# Altium schematic sheet HD-JYQ70-YD03-POWER.SchDoc
size B; PageSetup: Record=PageOptions|CenterHorizontal=True|CenterVertical=True|PrintScale=0.74|XCorrection=1.00|YCorrection=1.00|PrintKind=1|BorderSize=5000000|LeftOffset=0|BottomOffset=0|Orientation=2|PaperLength=1000|PaperWidth=1000|Scale=100|PaperSource=7|PrintQuality=-3|MediaType=1|DitherType=10|PrintScaleMode=1|PaperKind=A4 (210 x 297 mm)|PaperIndex=9
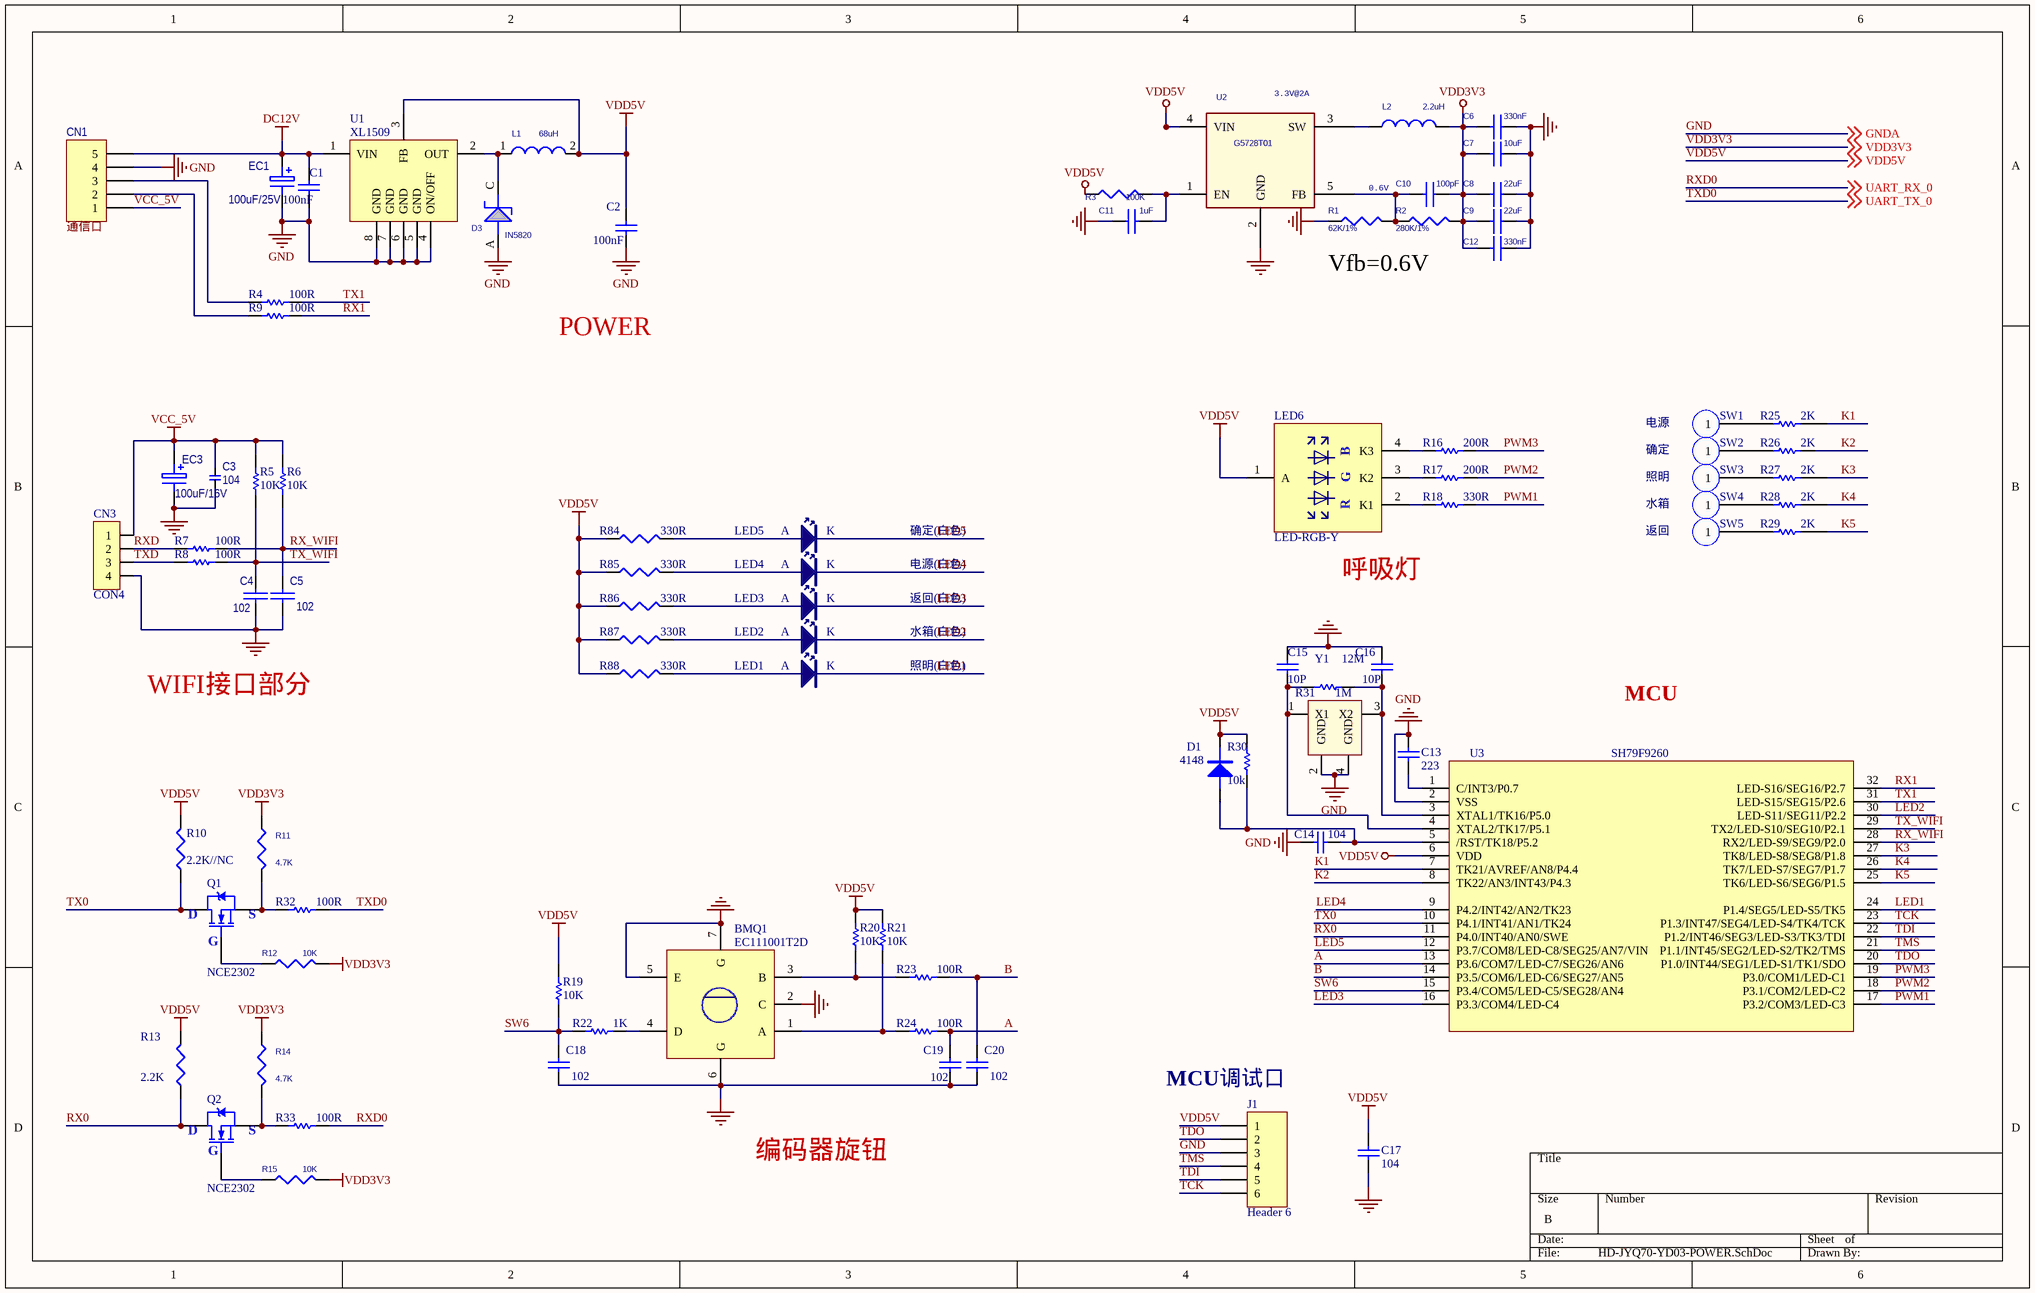
[diagram p0: HD-JYQ70-YD03-POWER.SchDoc]

## Parts
BMQ1  EC111001T2D  [EC111001T2D]
C1  value 100nF  [X-0603C]  (hidden comment: Cap Semi)
C2  value 100nF  [X-0603C]  (hidden comment: Cap Semi)
C3  104  [X-0603C]
C4  102  [X-0603C]
C5  102  [X-0603C]
C6  330nF  [X-0603C]
C7  10uF  [X-0805C]
C8  22uF  [X-0805C]
C9  22uF  [X-0805C]
C10  100pF  [X-0603C]
C11  1uF  [X-0603C]
C12  330nF  [X-0805C]
C13  value 223  [X-0603C]  (hidden comment: Cap)
C14  value 104  [X-0603C]  (hidden comment: Cap)
C15  value 10P  [X-0603C]  (hidden comment: Cap)
C16  value 10P  [X-0603C]  (hidden comment: Cap)
C17  value 104  [X-0603C]  (hidden comment: Cap)
C18  value 102  [X-0603C]  (hidden comment: Cap)
C19  value 102  [X-0603C]  (hidden comment: Cap)
C20  value 102  [X-0603C]  (hidden comment: Cap)
CN1  通信口  [JC25-5Y]
CN3  CON4  [CoN-JC25-4Y]
D1  4148  [H-DIODE_SMA]
D3  IN5820  [DO-214AC]
EC1  100uF/25V  [C6*8*6]
EC3  100uF/16V  [C6*8*6]
J1  Header 6  [CON_TJC8-6A]
L1  68uH  [ZAD-6045]
L2  2.2uH  [ZAD-4030]
LED1  (no value)  [LED2P-5MM]
LED2  (no value)  [LED2P-5MM]
LED3  (no value)  [LED2P-5MM]
LED4  (no value)  [LED2P-5MM]
LED5  (no value)  [LED2P-5MM]
LED6  LED-RGB-Y  [LED-RGB-Y]
Q1  NCE2302  [X-SOT23]
Q2  NCE2302  [X-SOT23]
R1  62K/1%  [X-0603R]
R2  280K/1%  [X-0603R]
R3  100K  [X-0603R]
R4  value 100R  [X-0603R]  (hidden comment: Res1)
R5  value 10K  [X-0603R]  (hidden comment: Res1)
R6  value 10K  [X-0603R]  (hidden comment: Res1)
R7  value 100R  [X-0603R]  (hidden comment: Res1)
R8  value 100R  [X-0603R]  (hidden comment: Res1)
R9  value 100R  [X-0603R]  (hidden comment: Res1)
R10  value 2.2K//NC  [X-0603R]  (hidden comment: 2.2K)
R11  4.7K  [X-0603R]
R12  10K  [X-0603R]
R13  2.2K  [X-0603R]
R14  4.7K  [X-0603R]
R15  10K  [X-0603R]
R16  value 200R  [X-0603R]  (hidden comment: Res1)
R17  value 200R  [X-0603R]  (hidden comment: Res1)
R18  value 330R  [X-0603R]  (hidden comment: Res1)
R19  value 10K  [X-0603R]  (hidden comment: Res1)
R20  value 10K  [X-0603R]  (hidden comment: Res1)
R21  value 10K  [X-0603R]  (hidden comment: Res1)
R22  value 1K  [X-0603R]  (hidden comment: Res1)
R23  value 100R  [X-0603R]  (hidden comment: Res1)
R24  value 100R  [X-0603R]  (hidden comment: Res1)
R25  value 2K  [X-0603R]  (hidden comment: Res1)
R26  value 2K  [X-0603R]  (hidden comment: Res1)
R27  value 2K  [X-0603R]  (hidden comment: Res1)
R28  value 2K  [X-0603R]  (hidden comment: Res1)
R29  value 2K  [X-0603R]  (hidden comment: Res1)
R30  value 10k  [X-0603R]  (hidden comment: Res1)
R31  value 1M  [X-0603R]  (hidden comment: Res1)
R32  value 100R  [X-0603R]  (hidden comment: Res1)
R33  value 100R  [X-0603R]  (hidden comment: Res1)
R84  value 330R  [X-0603R]  (hidden comment: 10K)
R85  value 330R  [X-0603R]  (hidden comment: 10K)
R86  value 330R  [X-0603R]  (hidden comment: 10K)
R87  value 330R  [X-0603R]  (hidden comment: 10K)
R88  value 330R  [X-0603R]  (hidden comment: 10K)
SW1  返回  [SW-14]
SW2  确定  [SW-14]
SW3  电源  [SW-14]
SW4  水箱  [SW-14]
SW5  照明  [SW-14]
U1  XL1509  [X-SOP8-50-150]
U2  G5728T01  [TSOT25-5P$2F$0.95$2F$3X3]
U3  SH79F9260  [X-QFP32-080-0707L]
Y1  12M  [CRYSTALS-SMD-320X250]

## Nets
DC12V: C1.2 CN1.5 EC1.1 U1.1(VIN)
GND: BMQ1.2(C) BMQ1.5(E) BMQ1.6(G) BMQ1.7(G) C1.1 C2.1 C3.2 C4.1 C5.1 C6.1 C7.1 C8.1 C9.1 C11.1 C12.1 C13.2 C14.1 C15.2 C16.2 C17.1 C18.1 C19.1 C20.1 CN1.4 CN3.4 D3.A(ANODE) EC1.2 EC3.2 J1.3 R1.1 U1.4(ON/OFF) U1.5(GND) U1.6(GND) U1.7(GND) U1.8(GND) U2.2(GND) U3.2(VSS) Y1.2(GND) Y1.4(GND) ; off-sheet GNDA  [also labelled GNDA]
VCC_5V: C3.1 CN1.1 CN3.1 EC3.1 R5.2 R6.2
VDD3V3: C6.2 C7.2 C8.2 C9.2 C10.1 C12.2 L2.2 R2.2 R11.1 R12.2 R14.1 R15.2 ; off-sheet VDD3V3
VDD5V: C2.2 C17.2 D1.2(K) J1.1 L1.2 LED6.1(A) R3.1 R10.2 R13.2 R19.2 R20.2 R21.2 R30.2 R84.1 R85.1 R86.1 R87.1 R88.1 U1.3(FB) U2.4(VIN) U3.6(VDD) ; off-sheet VDD5V
A: C19.2 R24.2 U3.13(P3.6/COM7/LED-C7/SEG26/AN6)
B: C20.2 R23.2 U3.14(P3.5/COM6/LED-C6/SEG27/AN5)
K1: R25.2 U3.7(TK21/AVREF/AN8/P4.4)
K2: R26.2 U3.8(TK22/AN3/INT43/P4.3)
K3: R27.2 U3.27(TK8/LED-S8/SEG8/P1.8)
K4: R28.2 U3.26(TK7/LED-S7/SEG7/P1.7)
K5: R29.2 U3.25(TK6/LED-S6/SEG6/P1.5)
LED1: LED1.K U3.24(P1.4/SEG5/LED-S5/TK5)
LED2: LED2.K U3.30(LED-S11/SEG11/P2.2)
LED3: LED3.K U3.16(P3.3/COM4/LED-C4)
LED4: LED4.K U3.9(P4.2/INT42/AN2/TK23)
LED5: LED5.K U3.12(P3.7/COM8/LED-C8/SEG25/AN7/VIN)
PWM1: R18.2 U3.17(P3.2/COM3/LED-C3)
PWM2: R17.2 U3.18(P3.1/COM2/LED-C2)
PWM3: R16.2 U3.19(P3.0/COM1/LED-C1)
RX0: Q2.2(D) R13.1 U3.11(P4.0/INT40/AN0/SWE)
RX1: R9.2 U3.32(LED-S16/SEG16/P2.7)
RX_WIFI: C5.2 R6.1 R7.2 U3.28(RX2/LED-S9/SEG9/P2.0)
RXD: CN3.2 R7.1
RXD0: R33.2 ; off-sheet UART_RX_0  [also labelled UART_RX_0]
SW6: C18.2 R19.1 R22.1 U3.15(P3.4/COM5/LED-C5/SEG28/AN4)
TCK: J1.6 U3.23(P1.3/INT47/SEG4/LED-S4/TK4/TCK)
TDI: J1.5 U3.22(P1.2/INT46/SEG3/LED-S3/TK3/TDI)
TDO: J1.2 U3.20(P1.0/INT44/SEG1/LED-S1/TK1/SDO)
TMS: J1.4 U3.21(P1.1/INT45/SEG2/LED-S2/TK2/TMS)
TX0: Q1.2(D) R10.1 U3.10(P4.1/INT41/AN1/TK24)
TX1: R4.2 U3.31(LED-S15/SEG15/P2.6)
TX_WIFI: C4.2 R5.1 R8.2 U3.29(TX2/LED-S10/SEG10/P2.1)
TXD: CN3.3 R8.1
TXD0: R32.2 ; off-sheet UART_TX_0  [also labelled UART_TX_0]
NetBMQ1_1: BMQ1.1(A) R21.1 R24.1
NetBMQ1_3: BMQ1.3(B) R20.1 R23.1
NetBMQ1_4: BMQ1.4(D) R22.2
NetC10_2: C10.2 R1.2 R2.1 U2.5(FB)
NetC11_2: C11.2 R3.2 U2.1(EN)
NetC13_1: C13.1 U3.1(C/INT3/P0.7)
NetC14_2: C14.2 D1.1(A) R30.1 U3.5(/RST/TK18/P5.2)
NetC15_1: C15.1 R31.2 U3.4(XTAL2/TK17/P5.1) Y1.1(X1)
NetC16_1: C16.1 R31.1 U3.3(XTAL1/TK16/P5.0) Y1.3(X2)
NetCN1_2: CN1.2 R9.1
NetCN1_3: CN1.3 R4.1
NetD3_C: D3.C(CATHODE) L1.1 U1.2(OUT)
NetL2_1: L2.1 U2.3(SW)
NetLED1_A: LED1.A R88.2
NetLED2_A: LED2.A R87.2
NetLED3_A: LED3.A R86.2
NetLED4_A: LED4.A R85.2
NetLED5_A: LED5.A R84.2
NetLED6_2: LED6.2(K1) R18.1
NetLED6_3: LED6.3(K2) R17.1
NetLED6_4: LED6.4(K3) R16.1
NetQ1_1: Q1.1(G) R12.1
NetQ1_3: Q1.3(S) R11.2 R32.1
NetQ2_1: Q2.1(G) R15.1
NetQ2_3: Q2.3(S) R14.2 R33.1
NetR25_1: R25.1 SW1.1
NetR26_1: R26.1 SW2.1
NetR27_1: R27.1 SW3.1
NetR28_1: R28.1 SW4.1
NetR29_1: R29.1 SW5.1

## Notes on the sheet
- (near U2) 3.3V@2A
- 0.6V
- Vfb=0.6V
- POWER
- 电源(白色)
- 确定(白色)
- 返回(白色)
- 水箱(白色)
- 呼吸灯
- WIFI接口部分
- 照明(白色)
- MCU
- (near Q1) D
- (near Q1) G
- (near Q1) S
- (near J1) MCU调试口
- (near Q2) D
- (near Q2) G
- (near Q2) S
- 编码器旋钮
- (in symbol LED-RGB-Y) B; G; R

## Library data of the parts
C1 C2 = Cap Semi: Capacitor (Semiconductor SIM Model); Published: 8-Jun-2000; LatestRevisionDate: 29-May-2009; LatestRevisionNote: IPC-7351 Footprint Added.; PackageReference: C1206; Publisher: Altium Limited; PackageDescription: Chip Capacitor
C3 = C1: 贴片电容
C4 C5 = CAP1: 贴片电容
C6 C11 = CAP NP_0: Voltage: X5R/10V
C7-C9 = CAP NP: Voltage: X5R/6.3V
C10 = CAP NP: Voltage: COG/5V
C12 = CAP NP: Voltage: X5R/10V
C13-C20 = Cap: Capacitor; Published: 8-Jun-2000; LatestRevisionDate: 17-Jul-2002; LatestRevisionNote: Re-released for DXP Platform.; PackageReference: RAD-0.3; Publisher: Altium Limited; PackageDescription: Radial Cap, Thru-Hole; 2 Leads; 0.3 in Pin Spacing
CN1 = Header 5: 孔座; LatestRevisionDate: 17-Jul-2002; LatestRevisionNote: Re-released for DXP Platform.; Publisher: Altium Limited
CN3 = CON4: Connector
D1 = DIODE
D3 = DIODE ZENER_0
EC1 EC3 = EC: 电解电容
J1 = Header 6: Header, 6-Pin; LatestRevisionDate: 17-Jul-2002; LatestRevisionNote: Re-released for DXP Platform.; Publisher: Altium Limited
L1 = L_SMD_15uH_3.2A
L2 = INDUCTOR_0
LED1-LED5 = LED
Q1 Q2 = NMOS-2: N-Channel Power MOSFET; Note: Pin 2 is electrically connected to pin 4.; Published: 8-Jun-2000; LatestRevisionDate: 17-Jul-2002; LatestRevisionNote: Re-released for DXP Platform.; DatasheetVersion: PD-9.814; PackageVersion: Feb-1997; PackageReference: TO-220AB; Publisher: Altium Limited; PackageDescription: TO, Thru-Hole, Vertical, Heatsink Mounted; 3 In-Line Leads; Pitch 2.54 mm; ComponentLink1Description: Manufacturer Link; ComponentLink1URL: http://www.irf.com/
R1-R3 = R
R4-R9 R16-R33 = Res1: Resistor; Published: 8-Jun-2000; LatestRevisionDate: 17-Jul-2002; LatestRevisionNote: Re-released for DXP Platform.; PackageReference: AXIAL-0.3; Publisher: Altium Limited; PackageDescription: Axial Device, Thru-Hole; 2 Leads; 0.3 in Pin Spacing
R10 R13 R84-R88 = Res3: Resistor; Published: 8-Jun-2000; LatestRevisionDate: 29-May-2009; LatestRevisionNote: IPC-7351 Footprint Added.; PackageReference: J1-0603; Publisher: Altium Limited; PackageDescription: Chip Resistor
  R13: Value: 2.2K
R11 R12 R14 R15 = R_Dup4
SW1-SW5 = SW
U2 = 05. IT7831TS_TSOT25
Y1 = 3225